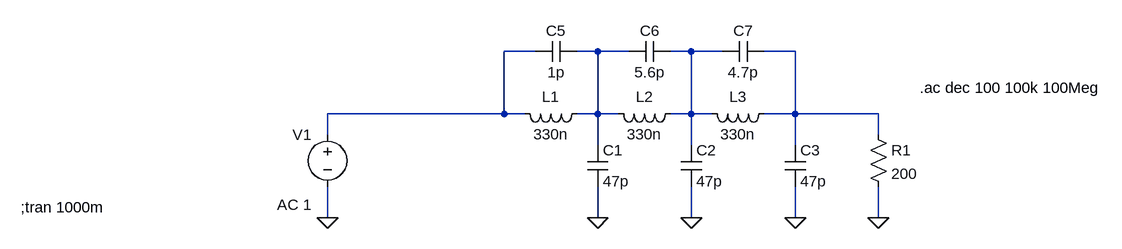
[diagram p0: schematic 901_output_filter.asc]
901_output_filter.asc, the LTspice schematic file:
Version 4
SHEET 1 2616 1748
WIRE 160 32 112 32
WIRE 256 32 224 32
WIRE 304 32 256 32
WIRE 400 32 368 32
WIRE 448 32 400 32
WIRE 560 32 512 32
WIRE 112 128 112 32
WIRE 112 128 -160 128
WIRE 144 128 112 128
WIRE 256 128 256 32
WIRE 256 128 224 128
WIRE 288 128 256 128
WIRE 400 128 400 32
WIRE 400 128 368 128
WIRE 432 128 400 128
WIRE 560 128 560 32
WIRE 560 128 512 128
WIRE 688 128 560 128
WIRE -160 160 -160 128
WIRE 688 160 688 128
WIRE 256 176 256 128
WIRE 400 176 400 128
WIRE 560 176 560 128
WIRE -160 288 -160 240
WIRE 256 288 256 240
WIRE 400 288 400 240
WIRE 560 288 560 240
WIRE 688 288 688 240
FLAG -160 288 0
FLAG 256 288 0
FLAG 400 288 0
FLAG 560 288 0
FLAG 688 288 0
SYMBOL voltage -160 144 M0
WINDOW 123 24 124 Left 2
WINDOW 39 0 0 Left 0
SYMATTR Value2 AC 1
SYMATTR InstName V1
SYMATTR Value ""
SYMBOL ind 240 112 R90
WINDOW 0 5 56 VBottom 2
WINDOW 3 32 56 VTop 2
SYMATTR InstName L1
SYMATTR Value 330n
SYMBOL ind 384 112 R90
WINDOW 0 5 56 VBottom 2
WINDOW 3 32 56 VTop 2
SYMATTR InstName L2
SYMATTR Value 330n
SYMBOL ind 528 112 R90
WINDOW 0 5 56 VBottom 2
WINDOW 3 32 56 VTop 2
SYMATTR InstName L3
SYMATTR Value 330n
SYMBOL cap 240 176 R0
SYMATTR InstName C1
SYMATTR Value 47p
SYMBOL cap 384 176 R0
SYMATTR InstName C2
SYMATTR Value 47p
SYMBOL cap 544 176 R0
SYMATTR InstName C3
SYMATTR Value 47p
SYMBOL res 672 144 R0
SYMATTR InstName R1
SYMATTR Value 200
SYMBOL cap 224 16 R90
WINDOW 0 0 32 VBottom 2
WINDOW 3 32 32 VTop 2
SYMATTR InstName C5
SYMATTR Value 1p
SYMBOL cap 368 16 R90
WINDOW 0 0 32 VBottom 2
WINDOW 3 32 32 VTop 2
SYMATTR InstName C6
SYMATTR Value 5.6p
SYMBOL cap 512 16 R90
WINDOW 0 0 32 VBottom 2
WINDOW 3 32 32 VTop 2
SYMATTR InstName C7
SYMATTR Value 4.7p
TEXT -632 272 Left 2 !;tran 1000m
TEXT 752 88 Left 2 !.ac dec 100 100k 100Meg

The netlist it stands for:
* 901_output_filter.asc
V1 N001 0 AC 1
L1 N002 N001 330n
L2 N003 N002 330n
L3 N004 N003 330n
C1 N002 0 47p
C2 N003 0 47p
C3 N004 0 47p
R1 N004 0 200
C5 N002 N001 1p
C6 N003 N002 5.6p
C7 N004 N003 4.7p
;tran 1000m
.ac dec 100 100k 100Meg
.backanno
.end